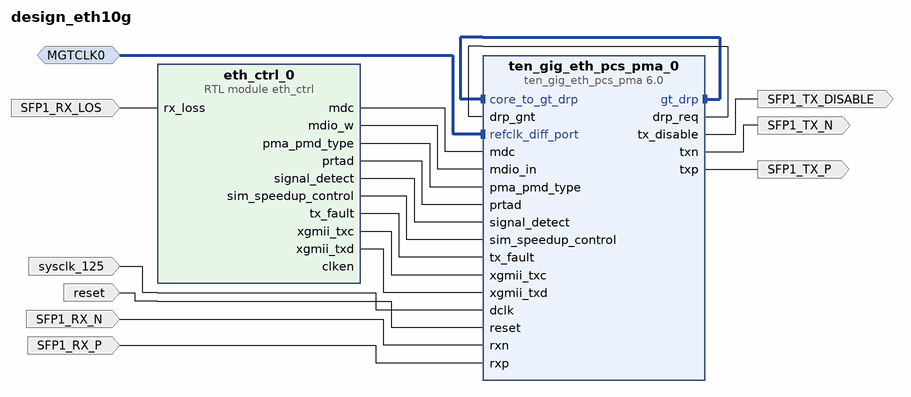
[diagram p0: block diagram of the top level]
# Vivado block design design_eth10g, xcku040-fbva676-1-c, Vivado 2018.2
create_bd_design design_eth10g

create_bd_intf_port -mode Slave -vlnv xilinx.com:interface:diff_clock_rtl:1.0 MGTCLK0
set_property -dict {CONFIG.FREQ_HZ 156250000} [get_bd_intf_ports MGTCLK0]
create_bd_port -dir I SFP1_RX_LOS
create_bd_port -dir I SFP1_RX_N
create_bd_port -dir I SFP1_RX_P
create_bd_port -dir O SFP1_TX_DISABLE
create_bd_port -dir O SFP1_TX_N
create_bd_port -dir O SFP1_TX_P
create_bd_port -dir I -type rst reset
set_property -dict {CONFIG.POLARITY ACTIVE_HIGH} [get_bd_ports reset]
create_bd_port -dir I -type clk sysclk_125
set_property -dict {CONFIG.PHASE 0.0 CONFIG.CLK_DOMAIN design_eth10g_clk_wiz_0_0_clk_100} [get_bd_ports sysclk_125]

create_bd_cell -type module -reference eth_ctrl eth_ctrl_0
create_bd_cell -type ip -vlnv xilinx.com:ip:ten_gig_eth_pcs_pma:6.0 ten_gig_eth_pcs_pma_0
set_property -dict [list \
  CONFIG.base_kr BASE-R \
  CONFIG.no_ebuff false \
  CONFIG.SupportLevel 1 \
  CONFIG.Locations X0Y8 \
  CONFIG.RefClk clk0 \
] [get_bd_cells ten_gig_eth_pcs_pma_0]

# ---- connections ----

connect_bd_intf_net [get_bd_intf_pins ten_gig_eth_pcs_pma_0/core_to_gt_drp] [get_bd_intf_pins ten_gig_eth_pcs_pma_0/gt_drp]
connect_bd_intf_net [get_bd_intf_ports MGTCLK0] [get_bd_intf_pins ten_gig_eth_pcs_pma_0/refclk_diff_port]
connect_bd_net -net dclk_1 [get_bd_ports sysclk_125] [get_bd_pins ten_gig_eth_pcs_pma_0/dclk]
# net eth_ctrl_0_clken has one end: eth_ctrl_0/clken
connect_bd_net [get_bd_pins eth_ctrl_0/mdc] [get_bd_pins ten_gig_eth_pcs_pma_0/mdc]
connect_bd_net [get_bd_pins eth_ctrl_0/mdio_w] [get_bd_pins ten_gig_eth_pcs_pma_0/mdio_in]
connect_bd_net [get_bd_pins eth_ctrl_0/pma_pmd_type] [get_bd_pins ten_gig_eth_pcs_pma_0/pma_pmd_type]
connect_bd_net [get_bd_pins eth_ctrl_0/prtad] [get_bd_pins ten_gig_eth_pcs_pma_0/prtad]
connect_bd_net [get_bd_pins eth_ctrl_0/signal_detect] [get_bd_pins ten_gig_eth_pcs_pma_0/signal_detect]
connect_bd_net [get_bd_pins eth_ctrl_0/sim_speedup_control] [get_bd_pins ten_gig_eth_pcs_pma_0/sim_speedup_control]
connect_bd_net [get_bd_pins eth_ctrl_0/tx_fault] [get_bd_pins ten_gig_eth_pcs_pma_0/tx_fault]
connect_bd_net [get_bd_ports reset] [get_bd_pins ten_gig_eth_pcs_pma_0/reset]
connect_bd_net -net rx_loss_1 [get_bd_ports SFP1_RX_LOS] [get_bd_pins eth_ctrl_0/rx_loss]
connect_bd_net -net rxn_1 [get_bd_ports SFP1_RX_N] [get_bd_pins ten_gig_eth_pcs_pma_0/rxn]
connect_bd_net -net rxp_1 [get_bd_ports SFP1_RX_P] [get_bd_pins ten_gig_eth_pcs_pma_0/rxp]
connect_bd_net [get_bd_pins ten_gig_eth_pcs_pma_0/drp_req] [get_bd_pins ten_gig_eth_pcs_pma_0/drp_gnt]
connect_bd_net [get_bd_pins ten_gig_eth_pcs_pma_0/tx_disable] [get_bd_ports SFP1_TX_DISABLE]
connect_bd_net [get_bd_pins ten_gig_eth_pcs_pma_0/txn] [get_bd_ports SFP1_TX_N]
connect_bd_net [get_bd_pins ten_gig_eth_pcs_pma_0/txp] [get_bd_ports SFP1_TX_P]
connect_bd_net [get_bd_pins eth_ctrl_0/xgmii_txc] [get_bd_pins ten_gig_eth_pcs_pma_0/xgmii_txc]
connect_bd_net [get_bd_pins eth_ctrl_0/xgmii_txd] [get_bd_pins ten_gig_eth_pcs_pma_0/xgmii_txd]

validate_bd_design
save_bd_design
